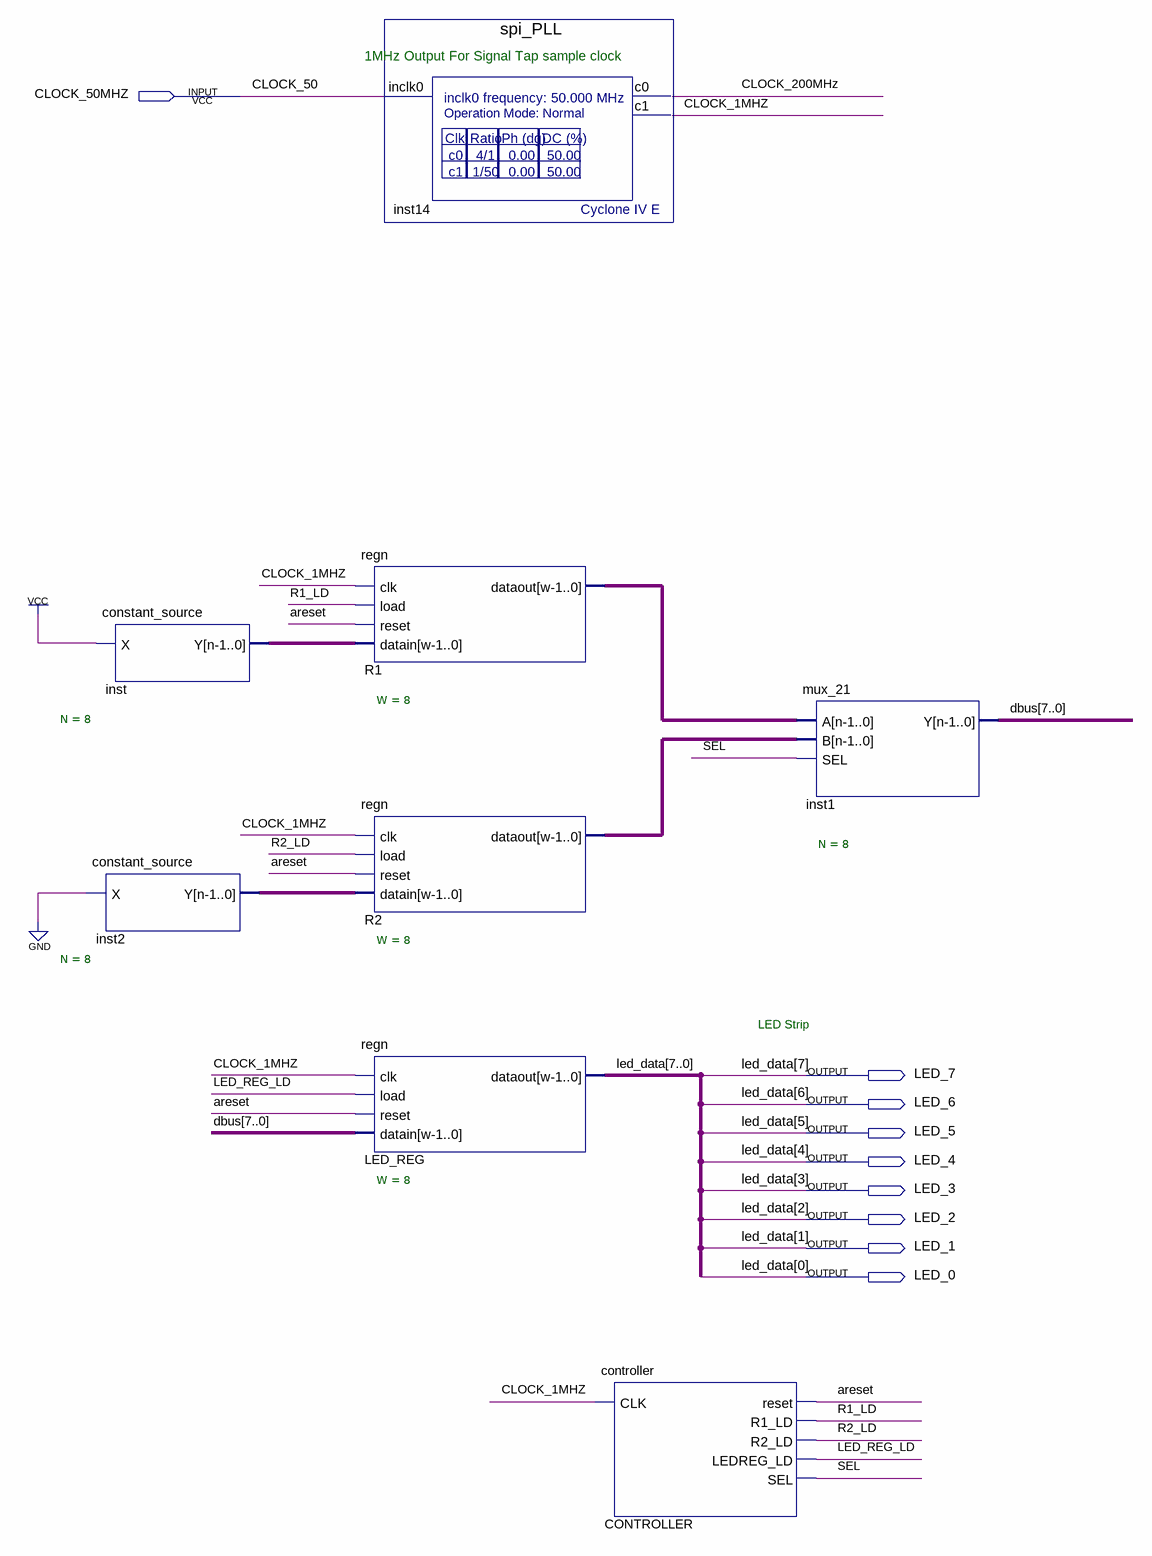
[diagram p0: schematic sheet]
// Quartus schematic spi_test.bdf as structural Verilog: 8 symbols, 9 pins
module spi_test (
  input  CLOCK_50MHZ,
  output LED_7,
  output LED_6,
  output LED_5,
  output LED_4,
  output LED_3,
  output LED_2,
  output LED_1,
  output LED_0
);

  wire areset, CLOCK_1MHZ, CLOCK_200MHz, LED_REG_LD, R1_LD, R2_LD, SEL;
  wire [7:0] dbus, inst2_y, inst_y, R1_dataout, R2_dataout;

  constant_source #(.N(8)) inst (.X(1'b1), .Y(inst_y));
  constant_source #(.N(8)) inst2 (.X(1'b0), .Y(inst2_y));
  regn #(.W(8)) R1 (.clk(CLOCK_1MHZ), .load(R1_LD), .reset(areset), .datain(inst_y), .dataout(R1_dataout));
  regn #(.W(8)) R2 (.clk(CLOCK_1MHZ), .load(R2_LD), .reset(areset), .datain(inst2_y), .dataout(R2_dataout));
  regn #(.W(8)) LED_REG (
    .clk(CLOCK_1MHZ), .load(LED_REG_LD), .reset(areset), .datain(dbus),
    .dataout({LED_7, LED_6, LED_5, LED_4, LED_3, LED_2, LED_1, LED_0}));
  spi_PLL inst14 (.inclk0(CLOCK_50MHZ), .c0(CLOCK_200MHz), .c1(CLOCK_1MHZ));
  controller CONTROLLER (
    .CLK(CLOCK_1MHZ), .reset(areset), .R1_LD(R1_LD), .R2_LD(R2_LD), .LEDREG_LD(LED_REG_LD), .SEL(SEL));
  mux_21 #(.N(8)) inst1 (.A(R1_dataout), .B(R2_dataout), .SEL(SEL), .Y(dbus));

  // Other names for the same wires on the sheet: CLOCK_50 = CLOCK_50MHZ;
  //   led_data[7:0] = {LED_7, LED_6, LED_5, LED_4, LED_3, LED_2, LED_1, LED_0}

  // Notes on the sheet:
  //   1MHz Output For Signal Tap sample clock
  //   LED Strip
endmodule
